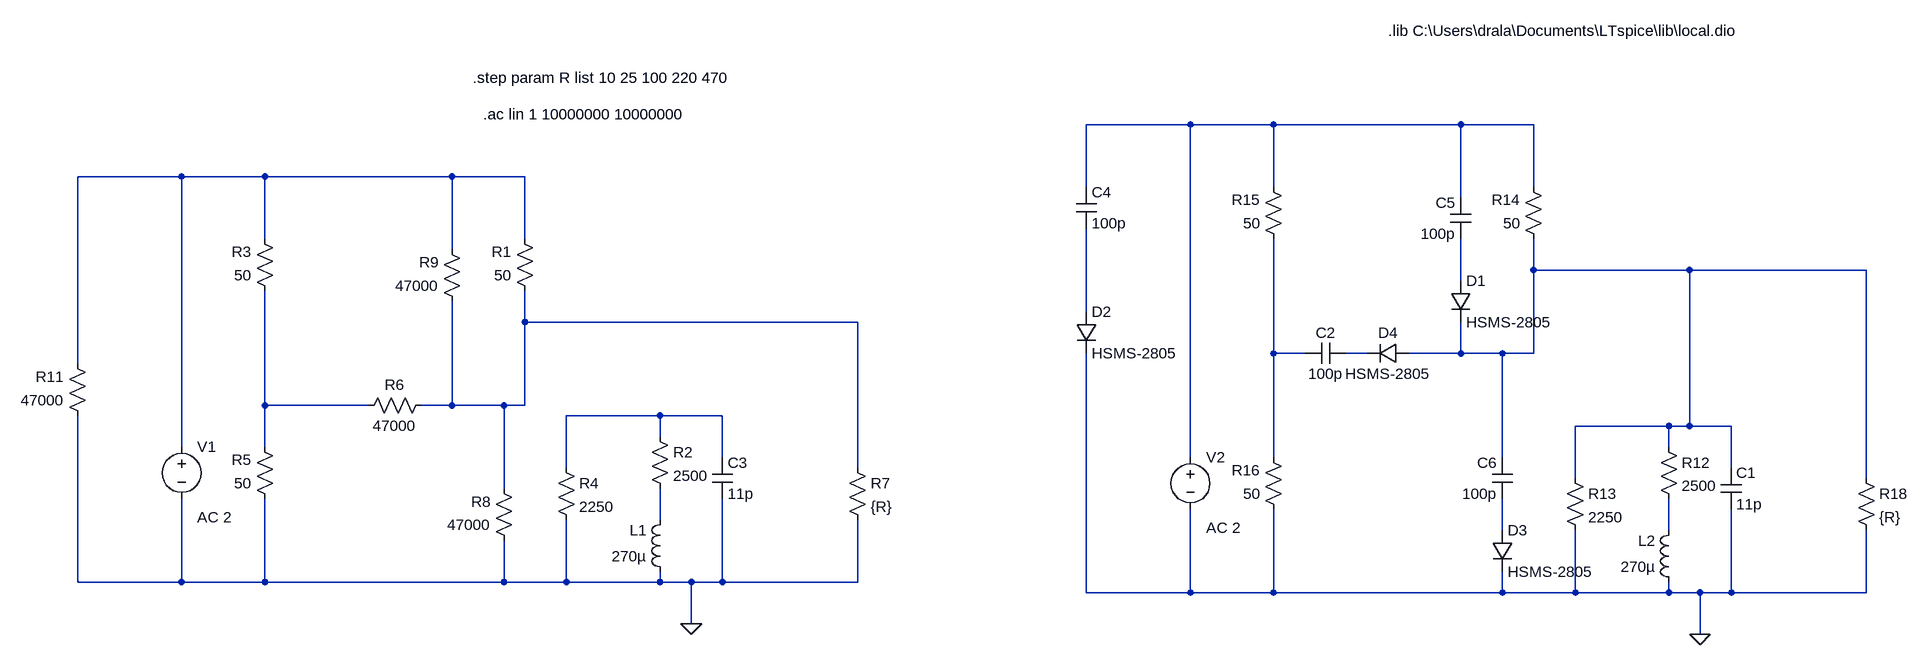
[diagram p0: schematic Output Port Model with Bridge elements.asc]
Output Port Model with Bridge elements.asc, the LTspice schematic file:
Version 4
SHEET 1 2636 884
WIRE 1360 -384 1200 -384
WIRE 1488 -384 1360 -384
WIRE 1776 -384 1488 -384
WIRE 1888 -384 1776 -384
WIRE -192 -304 -352 -304
WIRE -64 -304 -192 -304
WIRE 224 -304 -64 -304
WIRE 336 -304 224 -304
WIRE 1200 -288 1200 -384
WIRE 1488 -288 1488 -384
WIRE 1888 -288 1888 -384
WIRE 1776 -272 1776 -384
WIRE -64 -208 -64 -304
WIRE 336 -208 336 -304
WIRE 224 -192 224 -304
WIRE 1888 -160 1888 -208
WIRE 2128 -160 1888 -160
WIRE 2400 -160 2128 -160
WIRE 1776 -144 1776 -208
WIRE 1200 -96 1200 -224
WIRE 336 -80 336 -128
WIRE 848 -80 336 -80
WIRE 1488 -32 1488 -208
WIRE 1536 -32 1488 -32
WIRE 1632 -32 1600 -32
WIRE 1776 -32 1776 -80
WIRE 1776 -32 1696 -32
WIRE 1840 -32 1776 -32
WIRE 1888 -32 1888 -160
WIRE 1888 -32 1840 -32
WIRE -352 -16 -352 -304
WIRE -64 48 -64 -128
WIRE 96 48 -64 48
WIRE 224 48 224 -112
WIRE 224 48 176 48
WIRE 304 48 224 48
WIRE 336 48 336 -80
WIRE 336 48 304 48
WIRE 544 64 400 64
WIRE 640 64 544 64
WIRE 2096 80 1952 80
WIRE 2128 80 2128 -160
WIRE 2128 80 2096 80
WIRE 2192 80 2128 80
WIRE 544 96 544 64
WIRE -192 112 -192 -304
WIRE -64 112 -64 48
WIRE 2096 112 2096 80
WIRE 640 128 640 64
WIRE 1360 128 1360 -384
WIRE 1488 128 1488 -32
WIRE 1840 128 1840 -32
WIRE 400 144 400 64
WIRE 848 144 848 -80
WIRE 2192 144 2192 80
WIRE 1952 160 1952 80
WIRE 2400 160 2400 -160
WIRE 304 176 304 48
WIRE 544 224 544 176
WIRE 1840 240 1840 192
WIRE 2096 240 2096 192
WIRE -352 320 -352 64
WIRE -192 320 -192 192
WIRE -192 320 -352 320
WIRE -64 320 -64 192
WIRE -64 320 -192 320
WIRE 304 320 304 256
WIRE 304 320 -64 320
WIRE 400 320 400 224
WIRE 400 320 304 320
WIRE 544 320 544 304
WIRE 544 320 400 320
WIRE 592 320 544 320
WIRE 640 320 640 192
WIRE 640 320 592 320
WIRE 848 320 848 224
WIRE 848 320 640 320
WIRE 1200 336 1200 -32
WIRE 1360 336 1360 208
WIRE 1360 336 1200 336
WIRE 1488 336 1488 208
WIRE 1488 336 1360 336
WIRE 1840 336 1840 304
WIRE 1840 336 1488 336
WIRE 1952 336 1952 240
WIRE 1952 336 1840 336
WIRE 2096 336 2096 320
WIRE 2096 336 1952 336
WIRE 2144 336 2096 336
WIRE 2192 336 2192 208
WIRE 2192 336 2144 336
WIRE 2400 336 2400 240
WIRE 2400 336 2192 336
WIRE 592 384 592 320
WIRE 2144 400 2144 336
FLAG 592 384 0
FLAG 2144 400 0
SYMBOL ind 560 320 R180
WINDOW 0 36 80 Left 2
WINDOW 3 36 40 Left 2
SYMATTR InstName L1
SYMATTR Value 270µ
SYMATTR SpiceLine Rser=0.5
SYMBOL res 528 80 R0
SYMATTR InstName R2
SYMATTR Value 2500
SYMBOL res 384 128 R0
SYMATTR InstName R4
SYMATTR Value 2250
SYMBOL voltage -192 96 R0
WINDOW 123 24 124 Left 2
WINDOW 39 0 0 Left 0
SYMATTR Value2 AC 2
SYMATTR InstName V1
SYMATTR Value ""
SYMBOL res 352 -112 R180
WINDOW 0 36 76 Left 2
WINDOW 3 36 40 Left 2
SYMATTR InstName R1
SYMATTR Value 50
SYMBOL res -48 -112 R180
WINDOW 0 36 76 Left 2
WINDOW 3 36 40 Left 2
SYMATTR InstName R3
SYMATTR Value 50
SYMBOL res -48 208 R180
WINDOW 0 36 76 Left 2
WINDOW 3 36 40 Left 2
SYMATTR InstName R5
SYMATTR Value 50
SYMBOL res 192 32 R90
WINDOW 0 0 56 VBottom 2
WINDOW 3 32 56 VTop 2
SYMATTR InstName R6
SYMATTR Value 47000
SYMBOL res 832 128 R0
SYMATTR InstName R7
SYMATTR Value {R}
SYMBOL res 320 272 R180
WINDOW 0 36 76 Left 2
WINDOW 3 36 40 Left 2
SYMATTR InstName R8
SYMATTR Value 47000
SYMBOL res 240 -96 R180
WINDOW 0 36 76 Left 2
WINDOW 3 36 40 Left 2
SYMATTR InstName R9
SYMATTR Value 47000
SYMBOL cap 624 128 R0
SYMATTR InstName C3
SYMATTR Value 11p
SYMBOL res -336 80 R180
WINDOW 0 36 76 Left 2
WINDOW 3 36 40 Left 2
SYMATTR InstName R11
SYMATTR Value 47000
SYMBOL ind 2112 336 R180
WINDOW 0 36 80 Left 2
WINDOW 3 36 40 Left 2
SYMATTR InstName L2
SYMATTR Value 270µ
SYMATTR SpiceLine Rser=0.5
SYMBOL res 2080 96 R0
SYMATTR InstName R12
SYMATTR Value 2500
SYMBOL res 1936 144 R0
SYMATTR InstName R13
SYMATTR Value 2250
SYMBOL voltage 1360 112 R0
WINDOW 123 24 124 Left 2
WINDOW 39 0 0 Left 0
SYMATTR Value2 AC 2
SYMATTR InstName V2
SYMATTR Value ""
SYMBOL res 1904 -192 R180
WINDOW 0 36 76 Left 2
WINDOW 3 36 40 Left 2
SYMATTR InstName R14
SYMATTR Value 50
SYMBOL res 1504 -192 R180
WINDOW 0 36 76 Left 2
WINDOW 3 36 40 Left 2
SYMATTR InstName R15
SYMATTR Value 50
SYMBOL res 1504 224 R180
WINDOW 0 36 76 Left 2
WINDOW 3 36 40 Left 2
SYMATTR InstName R16
SYMATTR Value 50
SYMBOL res 2384 144 R0
SYMATTR InstName R18
SYMATTR Value {R}
SYMBOL cap 2176 144 R0
SYMATTR InstName C1
SYMATTR Value 11p
SYMBOL cap 1600 -48 R90
WINDOW 0 0 32 VBottom 2
WINDOW 3 32 32 VTop 2
SYMATTR InstName C2
SYMATTR Value 100p
SYMBOL cap 1184 -224 M180
WINDOW 0 24 56 Left 2
WINDOW 3 24 8 Left 2
SYMATTR InstName C4
SYMATTR Value 100p
SYMBOL cap 1792 -208 R180
WINDOW 0 24 56 Left 2
WINDOW 3 24 8 Left 2
SYMATTR InstName C5
SYMATTR Value 100p
SYMBOL cap 1856 192 R180
WINDOW 0 24 56 Left 2
WINDOW 3 24 8 Left 2
SYMATTR InstName C6
SYMATTR Value 100p
SYMBOL diode 1760 -144 R0
SYMATTR InstName D1
SYMATTR Value HSMS-2805
SYMBOL diode 1184 -96 R0
SYMATTR InstName D2
SYMATTR Value HSMS-2805
SYMBOL diode 1824 240 R0
SYMATTR InstName D3
SYMATTR Value HSMS-2805
SYMBOL diode 1696 -48 R90
WINDOW 0 0 32 VBottom 2
WINDOW 3 32 32 VTop 2
SYMATTR InstName D4
SYMATTR Value HSMS-2805
TEXT 272 -400 Left 2 !.ac lin 1 10000000 10000000
TEXT 256 -456 Left 2 !.step param R list 10 25 100 220 470
TEXT 1664 -528 Left 2 !.lib C:\\Users\\drala\\Documents\\LTspice\\lib\\local.dio

The netlist it stands for:
* Output Port Model with Bridge elements.asc
L1 0 N011 270µ Rser=0.5
R2 N010 N011 2500
R4 N010 0 2250
V1 N002 0 AC 2
R1 N006 N002 50
R3 N009 N002 50
R5 0 N009 50
R6 N006 N009 47000
R7 N006 0 {R}
R8 0 N006 47000
R9 N006 N002 47000
C3 N010 0 11p
R11 0 N002 47000
L2 0 N013 270µ Rser=0.5
R12 N003 N013 2500
R13 N003 0 2250
V2 N001 0 AC 2
R14 N003 N001 50
R15 N007 N001 50
R16 0 N007 50
R18 N003 0 {R}
C1 N003 0 11p
C2 N008 N007 100p
C4 N005 N001 100p
C5 N004 N001 100p
C6 N012 N003 100p
D1 N004 N003 HSMS-2805
D2 N005 0 HSMS-2805
D3 N012 0 HSMS-2805
D4 N003 N008 HSMS-2805
.model D D
.lib standard.dio
.ac lin 1 10000000 10000000
.step param R list 10 25 100 220 470
.lib C:\Users\drala\Documents\LTspice\lib\local.dio
.backanno
.end